# Altium schematic sheet Sheet1.SchDoc
size A3; SheetNumber: 1; SheetTotal: 2
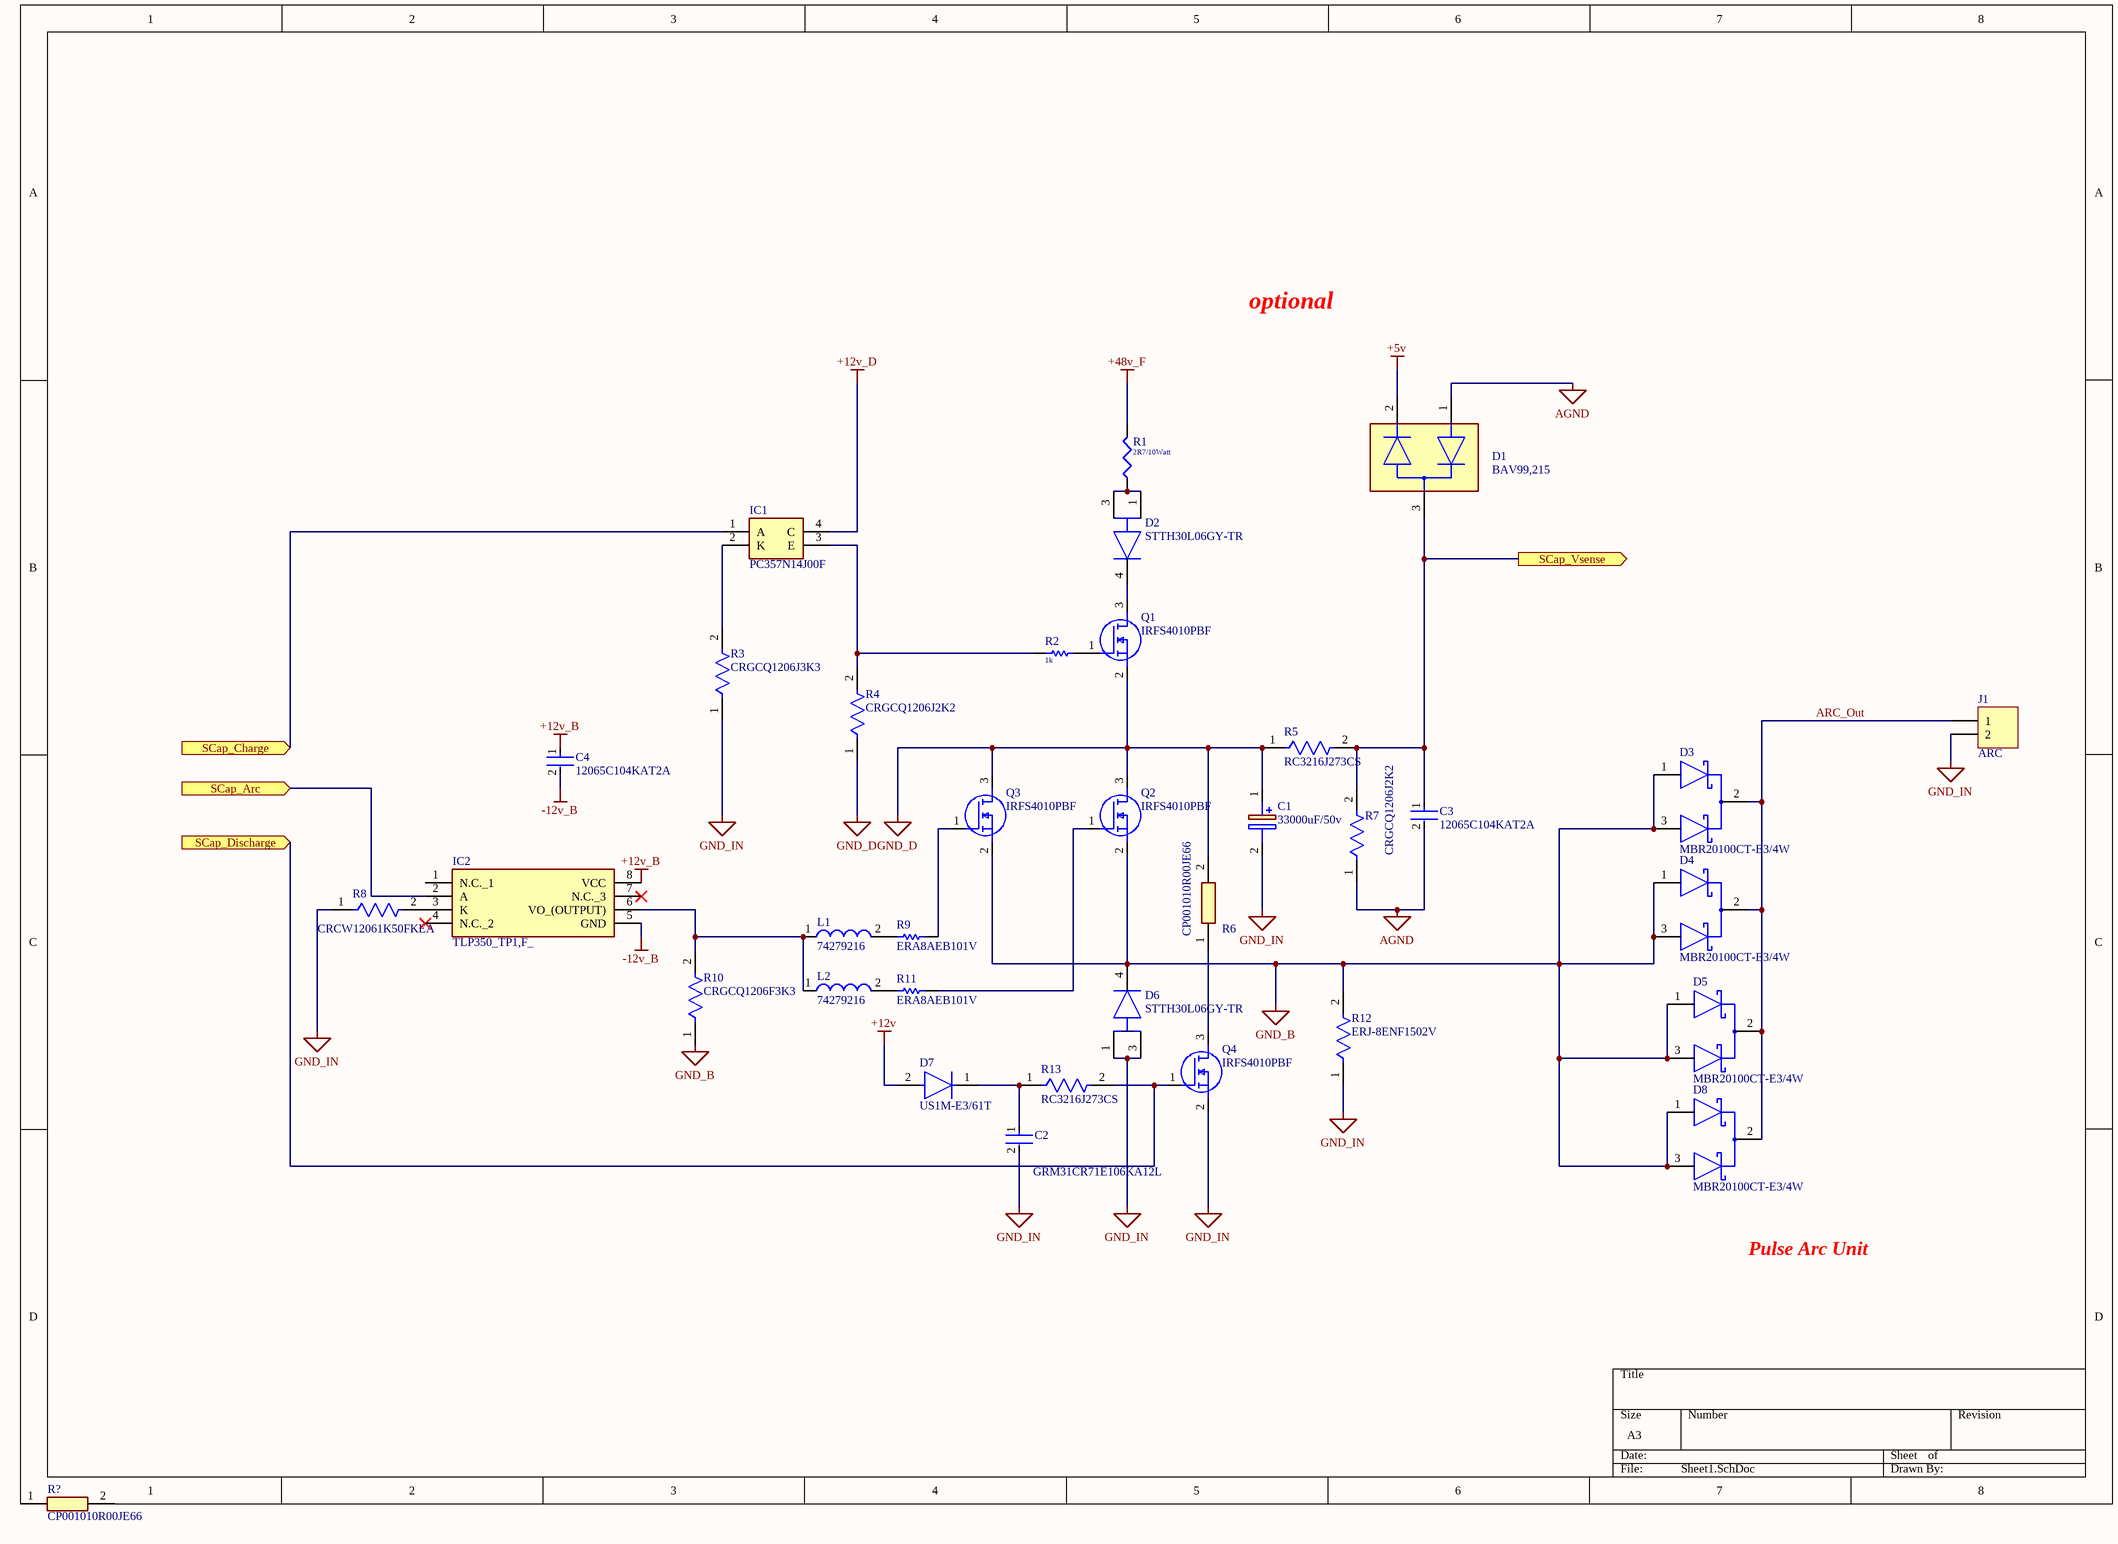
[diagram p0: Sheet1.SchDoc]

## Parts
C1  33000uF/50v  [CAPPRD1000W190D3550H8200]
C2  GRM31CR71E106KA12L  [FP-GRM31C-0_2-e0_3_0_8-MFG]
C3  12065C104KAT2A  [FP-1206-L_3_2_0_2-W_1_6_0-MFG]
C4  12065C104KAT2A  [FP-1206-L_3_2_0_2-W_1_6_0-MFG]
D1  BAV99,215  [FP-SOT23-MFG]
D2  STTH30L06GY-TR  [FP-D2PAK-MFG]
D3  MBR20100CT-E3/4W  [FP-MBR20100CT-E3-4W-MFG]
D4  MBR20100CT-E3/4W  [FP-MBR20100CT-E3-4W-MFG]
D5  MBR20100CT-E3/4W  [FP-MBR20100CT-E3-4W-MFG]
D6  STTH30L06GY-TR  [FP-D2PAK-MFG]
D7  US1M-E3/61T  [FP-95400-MFG]
D8  MBR20100CT-E3/4W  [FP-MBR20100CT-E3-4W-MFG]
IC1  PC357N14J00F  [SOP254P675X300-4N]
IC2  TLP350_TP1,F_  [DIP762W60P254L966H485Q8N]
J1  ARC  [PHM_TERMINAL2-PWR-10mm]
L1  74279216  [SMD-1206]
L2  74279216  [SMD-1206]
Q1  IRFS4010PBF  [IDB30E60]
Q2  IRFS4010PBF  [IDB30E60]
Q3  IRFS4010PBF  [IDB30E60]
Q4  IRFS4010PBF  [IDB30E60]
R1  2R7/10Watt  [PHM_AXIAL2.0]
R2  1k  [PHM_CR3216-1206]
R3  CRGCQ1206J3K3  [FP-CRGCQ1206-IPC_C]
R4  CRGCQ1206J2K2  [FP-CRGCQ1206-IPC_C]
R5  RC3216J273CS  [FP-RC3216-IPC_A]
R6  CP001010R00JE66  [CP001027K00JE663]
R7  CRGCQ1206J2K2  [FP-CRGCQ1206-IPC_C]
R8  CRCW12061K50FKEA  [FP-CRCW1206-e3-IPC_C]
R9  ERA8AEB101V  [RESC3216X70X50NL20T25]
R10  CRGCQ1206F3K3  [FP-CRGCQ1206-IPC_C]
R11  ERA8AEB101V  [RESC3216X70X50NL20T25]
R12  ERJ-8ENF1502V  [FP-ERJ8EN-MFG]
R13  RC3216J273CS  [FP-RC3216-IPC_A]
R?  CP001010R00JE66  [CP001027K00JE663]

## Ports
SCap_Arc (in), SCap_Charge (in), SCap_Discharge (in), SCap_Vsense (out)

## Nets
+5v: D1.2
+12v: D7.2(A)
+12v_B: C4.1 IC2.8(VCC)
+12v_D: IC1.4(C)
+48v_F: R1.2
-12v_B: C4.2 IC2.5(GND)
AGND: C3.2 D1.1 R7.1
GND_B: D3.1(1_ANODE) D3.3(2_ANODE) D4.1(1_ANODE) D4.3(2_ANODE) D5.1(1_ANODE) D5.3(2_ANODE) D6.4(K) D8.1(1_ANODE) D8.3(2_ANODE) Q2.2(S) Q3.2(S) R10.1 R12.2
GND_D: C1.1(+) Q1.2(S) Q2.3(D) Q3.3(D) R4.1 R5.1 R6.2
GND_IN: C1.2(-) C2.2 D6.1(A) D6.3(A) J1.2 Q4.2(S) R3.1 R8.1 R12.1
ARC_Out: D3.2(COMMON_CATHODE) D4.2(COMMON_CATHODE) D5.2(COMMON_CATHODE) D8.2(COMMON_CATHODE) J1.1
SCap_Arc: IC2.2(A) ; port SCap_Arc
SCap_Charge: IC1.1(A) ; port SCap_Charge
SCap_Discharge: Q4.1(G) R13.2 ; port SCap_Discharge
SCap_Vsense: C3.1 D1.3 R5.2 R7.2 ; port SCap_Vsense
NetC2_1: C2.1 D7.1(C) R13.1
NetD2_1: D2.1(A) D2.3(A) R1.1
NetD2_4: D2.4(K) Q1.3(D)
NetIC1_2: IC1.2(K) R3.2
NetIC1_3: IC1.3(E) R2.1 R4.2
NetIC2_3: IC2.3(K) R8.2
NetIC2_6: IC2.6(VO_(OUTPUT)) L1.1 L2.1 R10.2
NetL1_2: L1.2 R9.1
NetL2_2: L2.2 R11.1
NetQ1_1: Q1.1(G) R2.2
NetQ2_1: Q2.1(G) R11.2
NetQ3_1: Q3.1(G) R9.2
NetQ4_3: Q4.3(D) R6.1

Not connected (* = marked no-connect by the designer): IC2 1(N.C._1) 4(N.C._2)* 7(N.C._3)*; R? 1 2

## Notes on the sheet
- optional
- Pulse Arc Unit

## Library data of the parts
C1 = 380LX333M050A082: Capacitor Polarised; Manufacturer_Name: Cornell Dubilier; Datasheet Link: https://componentsearchengine.com/Datasheets/1/380LX333M050A082.pdf; Height: 82mm; Manufacturer_Part_Number: 380LX333M050A082; Mouser Part Number: 598-80LX333M050A082; Mouser Price/Stock: https://www.mouser.com/Search/Refine.aspx?Keyword=598-80LX333M050A082
C2 = CMP-06035-003589-1: Chip Multilayer Ceramic Capacitors for General Purpose, 1206, 10uF, X7R, 15%, 10%, 25V; Case Code (Imperial): 1206; Voltage Rating (DC): 25V; Voltage Rating: 25V; Length: 3.2mm; Lead Free: Lead Free; Thickness: 0.071inch; Package Quantity: 1; Width: 1.6mm; Max Operating Temperature: 125°C; Number of Pins: 2; Height: 1.6mm; Case Code (Metric): 3216; REACH SVHC: No SVHC; Radiation Hardening: No; Case/Package: 1206; Material: Ceramic; Tolerance: 10%; Voltage: 25V; Mount: Surface Mount; Packaging: Tape and Reel; Dielectric: X7R; Termination: SMD/SMT; Min Operating Temperature: -55°C; Capacitance: 10uF; Depth: 1.6mm
C3 C4 = CMP-2000-05018-2: General Purpose Ceramic Capacitor, 1206, 100nF, 10%, X7R, 15%, 50V; Dissipation Factor: 2.5%; Insulation Resistance: 100GR; Dielectric: X7R; Thickness: 0.037inch; Case Code (Imperial): 1206; Case Code (Metric): 3216; Dielectric Material: Ceramic; Width: 1.6mm; Voltage Rating (DC): 50V; Termination: SMD/SMT; Tolerance: 10%; REACH SVHC: No SVHC; Height: 0.94mm; Length: 3.2mm; Voltage: 50V; Capacitance: 100nF; Packaging: Tape and Reel; Depth: 1.6mm; Voltage Rating: 50V; Series: -; Contact Plating: Tin; Mount: Surface Mount; Package Quantity: 1; Construction: Flat; Max Operating Temperature: 125°C; Min Operating Temperature: -55°C; Case/Package: 1206; Lead Free: Lead Free; RoHS Compliant: Yes; Number of Pins: 2; Radiation Hardening: No
D1 = CMP-14399-000006-1: DIODE ARRAY GP 100V 215MA SOT23
D2 D6 = CMP-12188-000013-1: DIODE GEN PURP 600V 30A D2PAK; Manufacturer: STMicroelectronics; Automotive Grade: Grade 0; Max Junction Temp: +175°C; Standoff Height: 0.03mm; Max Surge Forward Current: 300A; Peak Reverse Current: 25uA; RoHS: TRUE; Temperature Range High: +175°C; ComponentLink2Description: Datasheet; Octopart: https://octopart.com/stth30l06gy-tr-stmicroelectronics-26451410; Manufacturer Part Number: STTH30L06GY-TR; Device Class L2: Diodes; Forward Current: 30A; Device Class L3: Rectifier Diodes; Digikey Description: DIODE GEN PURP 600V 30A D2PAK; Temperature: -40°C to +175°C; Temperature Range Low: -40°C; Max Repetitive Reverse Voltage: 600V; Category: Diode; Automotive: Yes; Package: D2PAK; Lead Free: Yes; Height: 4.83mm; Device Class L1: Discrete Semiconductors; ComponentLink2URL: https://www.st.com/resource/en/datasheet/stth30l06-y.pdf
D3-D5 D8 = CMP-00030-42878425-1: MBR20100CT-E3/4W Dual Common-Cathode High-Voltage Schottky Rectifier; Forward Voltage: 800mV; Max Junction Temperature (Tj): 150°C; Forward Current: 20A; Max Reverse Voltage (DC): 100V; Max Surge Current: 150A; Max Reverse Leakage Current: 100µA; Average Rectified Current: 10A; Element Configuration: Common Cathode; Length: 10.5156mm; Schedule B: 8541100080, 8541100080; Case/Package: TO-220AB; NexarPartId: 42878425; Number of Pins: 3; Min Operating Temperature: -65°C; Reverse Voltage: 100V; Height: 15.3162mm; Peak Non-Repetitive Surge Current: 150A; RoHS: Compliant; Max Operating Temperature: 150°C; Radiation Hardening: No; Lead Free: Lead Free; Mount: Through Hole; Max Repetitive Reverse Voltage (Vrrm): 100V; Max Forward Surge Current (Ifsm): 150A; Width: 4.699mm; Peak Reverse Current: 100µA
D7 = CMP-02540-000006-1: DIODE GEN PURP 1KV 1A DO214AC; Manufacturer: Vishay; Reverse Voltage: 1000V; Max Junction Temp: +150°C; Peak Reverse Current: 10uA; Max Surge Forward Current: 30A; Capacitance: 10pF; Description: Diode Standard 1000V 1A Surface Mount DO-214AC (SMA); Standoff Height: 0mm; Value: 10pF; Temperature Range Low: -55°C; Footprint Url: https://www.vishay.com/docs/95400/sma.pdf; Device Class L1: Discrete Semiconductors; Temperature: -55°C to +150°C; Max Repetitive Reverse Voltage: 1000V; ComponentLink2URL: https://www.vishay.com/docs/88768/us1.pdf; Category: Diode; Octopart: https://octopart.com/us1m-e3%2F61t-vishay-39553152; Digikey Description: DIODE GEN PURP 1KV 1A DO214AC; Device Class L2: Diodes; ComponentLink2Description: Datasheet; Height: 2.29mm; Automotive: No; RoHS: TRUE; Mouser Description: On a Reel of 1800, Vishay 1000V 1A, Silicon Junction Diode, 2-Pin DO-214AC US1M-E3/61T; Package: 95400; Forward Current: 1A; Temperature Range High: +150°C; Device Class L3: Rectifier Diodes; Manufacturer Part Number: US1M-E3/61T; Lead Free: Yes
IC1 = PC357N14J00F: Integrated Circuit; Manufacturer_Name: Sharp Microelectronics; Height: 3mm; Manufacturer_Part_Number: PC357N14J00F
IC2 = TLP350_TP1,F_: Integrated Circuit; Manufacturer_Name: Toshiba; Manufacturer_Part_Number: TLP350(TP1,F); Datasheet Link: https://toshiba.semicon-storage.com/info/docget.jsp?did=6217&prodName=TLP350; Height: 4.85mm; Mouser Part Number: 757-TLP350(TP1,F); Mouser Price/Stock: https://www.mouser.co.uk/ProductDetail/Toshiba/TLP350TP1F?qs=f0GatGUIxV3mNWWzK5NBiQ%3D%3D; Arrow Part Number: TLP350(TP1,F); Arrow Price/Stock: https://www.arrow.com/en/products/tlp350-tp1f/toshiba?region=asia
J1 = Header 2: Header, 2-Pin; Manufacturer: Generic Components; Class: Connector
L1 L2 = CMP-0220-00014-1: SMD EMI Suppression Ferrite Bead WE-CBF, Z = 1200 Ohm; PackageDescription: Chip Inductor, 2-Leads, Body 3.2 x 1.6 mm; PackageVersion: 2007; ComponentLink2URL: http://www.we-online.de/katalog/media/pdf/74279216.pdf; PackageReference: SMD-1206; ComponentLink2Description: Datasheet; ComponentLink1Description: Manufacturer Link; Impedance: 1200 Ohm; DatasheetVersion: Dec-2005; ComponentLink1URL: http://www.we-online.com
Q1-Q4 = IRFS4010PBF: MOSFET (N-Channel); Manufacturer_Name: Infineon; Datasheet Link: http://uk.rs-online.com/web/p/products/6887080; Manufacturer_Part_Number: IRFS4010PBF; Mouser Part Number: 942-IRFS4010PBF; Mouser Price/Stock: https://www.mouser.com/Search/Refine.aspx?Keyword=942-IRFS4010PBF
R1 = Res3: Resistor; Published: 8-Jun-2000; LatestRevisionDate: 29-May-2009; LatestRevisionNote: IPC-7351 Footprint Added.; PackageReference: J1-0603; Publisher: Altium Limited; PackageDescription: Chip Resistor; Value: 2R7/10Watt
R2 = Res1: Resistor; Published: 8-Jun-2000; LatestRevisionDate: 17-Jul-2002; LatestRevisionNote: Re-released for DXP Platform.; PackageReference: AXIAL-0.3; Publisher: Altium Limited; Value: 1k
R3 = CMP-03211-010046-1: CRGCQ1206 3.3KΩ 0.25W 5% ±100ppm/°C 200V; Manufacturer: TE Connectivity; Tolerance: 0.05; Automotive Grade: Grade 800; Temperature Coefficient: ±100ppm/°C; Device Class L2: Resistors; Device Class L1: Passive Components; Octopart: https://octopart.com/crgcq1206j3k3-te+connectivity-91018329; Resistance: 3.3KΩ; Ambient Temperature Range High: +70°C; ComponentLink2URL: https://www.te.com/commerce/DocumentDelivery/DDEController?Action=showdoc&DocId=Data+Sheet%7F1773204-3%7F1%7Fpdf%7FEnglish%7FENG_DS_1773204-3_1.pdf%7F4-2176347-809; Device Class L3: Chip SMD Resistors; Manufacturer Part Number: CRGCQ1206J3K3; ComponentLink2Description: Datasheet; Height: 0.65mm; Value: 3.3KΩ; Lead Free: Yes; Power Rating: 0.25W; Category: Res; Temperature: -55°C to +155°C; Composition: Thick Film; Package: CRGCQ1206; Temperature Range High: +155°C; Voltage Rating: 200V; Temperature Range Low: -55°C; Automotive: Yes; RoHS: TRUE; Series: CRGCQ; Ipc Land Pattern Name: RESC310155X55
R4 R7 = CMP-03211-005605-1: CRGCQ 1206 2K2 5%; Manufacturer: TE Connectivity; Value: 2.2KΩ; Automotive Grade: Grade 758; Tolerance: 0.05; Voltage Rating: 200V; Temperature Coefficient: ±100ppm/°C; Power Rating: 0.25W; Description: CRGCQ1206 2.2KΩ 0.25W 5% ±100ppm/°C 200V; Device Class L2: Resistors; Lead Free: Yes; ComponentLink2URL: https://www.te.com/commerce/DocumentDelivery/DDEController?Action=showdoc&DocId=Data+Sheet%7F1773204-3%7F1%7Fpdf%7FEnglish%7FENG_DS_1773204-3_1.pdf%7F4-2176347-767; RoHS: TRUE; Resistance: 2.2KΩ; Category: Res; Series: CRGCQ; Height: 0.65mm; Digikey Description: CRGCQ 1206 2K2 5%; Manufacturer Part Number: CRGCQ1206J2K2; Temperature: -55°C to +155°C; ComponentLink2Description: Datasheet; Device Class L3: Chip SMD Resistors; Temperature Range Low: -55°C; Composition: Thick Film; Ambient Temperature Range High: +70°C; Temperature Range High: +155°C; Package: CRGCQ1206; Octopart: https://octopart.com/crgcq1206j2k2-te+connectivity-91018322; Device Class L1: Passive Components; Ipc Land Pattern Name: RESC310155X55; Automotive: Yes
R5 R13 = CMP-13261-004377-1: Res Thick Film 1206 27kΩ 5% 0.25W ±100ppm/°C Molded SMD T/R; Voltage Rating (DC): 200V; Max Power Dissipation: 250mW; Resistance: 27kR; Height: 0.026inch; Case Code (Imperial): 1206; Contact Plating: Tin; Features: Moisture Resistant; Case Code (Metric): 3216; Length: 0.126inch; Case/Package: 1206; Packaging: Tape and Reel; Temperature Coefficient: 100ppm/°C; Number of Terminations: 2; Min Operating Temperature: -55°C; Tolerance: 5%; Radiation Hardening: No; Composition: Thick Film; Width: 0.063inch; Lead Free: Lead Free; Max Operating Temperature: 155°C
R6 R? = CP001010R00JE66: Resistor; Manufacturer_Name: Vishay; Datasheet Link: https://www.vishay.com/docs/30113/cphivol.pdf; Height: 13.5mm; Manufacturer_Part_Number: CP001010R00JE66; Mouser Part Number: 71-CP001010R00JE66; Mouser Price/Stock: https://www.mouser.com/Search/Refine.aspx?Keyword=71-CP001010R00JE66; Arrow Part Number: CP001010R00JE66; Arrow Price/Stock: https://www.arrow.com/en/products/cp001010r00je66/vishay
R8 = CMP-02407-002229-1: RES Thick Film, 1.5kΩ, 1%, 0.25W, 100ppm/°C, 1206; Voltage Rating (DC): 200V; Power Rating: 250mW; Resistance: 1.5kR; Depth: 1.6mm; Case/Package: 1206; Packaging: Tape and Reel; Military Standard: Not; Radiation Hardening: No; Features: Automotive AEC-Q200; Number of Terminations: 2; Case Code (Imperial): 1206; Width: 0.063inch; Voltage Rating: 200V; Tolerance: 1%; Max Operating Temperature: 155°C; Weight: 0.000353oz; Package Quantity: 10; Temperature Coefficient: 100ppm/°C; Lead Free: Lead Free; Height: 0.024inch; Max Power Dissipation: 250mW; Termination: SMD/SMT; Length: 3.2mm; Contact Plating: Tin; Composition: Thick Film; Min Operating Temperature: -55°C; Case Code (Metric): 3216
R9 R11 = CMP-2003-04405-1: Manufacturer: Panasonic; Part Number: ERA8AEB101V
R10 = CMP-03211-006652-1: CRGCQ1206 3.3KΩ 0.25W 1% ±100ppm/°C 200V; Manufacturer: TE Connectivity; Tolerance: 0.01; Automotive Grade: Grade 799; Height: 0.65mm; Automotive: Yes; Device Class L3: Chip SMD Resistors; Category: Res; Ambient Temperature Range High: +70°C; Resistance: 3.3KΩ; Mouser Description: Res Thick Film 1206 3.3K Ohm 1% 0.25W(1/4W) ±100ppm/C Pad SMD Automotive T/R; Octopart: https://octopart.com/crgcq1206f3k3-te+connectivity-91018281; ComponentLink2Description: Datasheet; RoHS: TRUE; Package: CRGCQ1206; Temperature Range High: +155°C; Series: CRGCQ; Voltage Rating: 200V; Device Class L1: Passive Components; Temperature Range Low: -55°C; Manufacturer Part Number: CRGCQ1206F3K3; Temperature Coefficient: ±100ppm/°C; ComponentLink2URL: https://www.te.com/commerce/DocumentDelivery/DDEController?Action=showdoc&DocId=Data+Sheet%7F1773204-3%7F1%7Fpdf%7FEnglish%7FENG_DS_1773204-3_1.pdf%7F4-2176347-808; Composition: Thick Film; Ipc Land Pattern Name: RESC310155X55; Device Class L2: Resistors; Lead Free: Yes; Power Rating: 0.25W; Temperature: -55°C to +155°C; Value: 3.3KΩ
R12 = CMP-2003-00118-2: NexarPartId: 55423295; Voltage Rating: 200V; Temperature Coefficient: 100ppm/°C; Resistance: 15kΩ; Max Power Dissipation: 250mW; Tolerance: 1%; Military Standard: Not; Min Operating Temperature: -55°C; Height: 600µm; Termination: SMD/SMT; Composition: Thick Film; Mount: Surface Mount; Voltage Rating (DC): 200V; Lead Free: Lead Free; Features: Automotive AEC-Q200; Radiation Hardening: No; Number of Terminations: 2; Contact Plating: Tin; Lifecycle Status: Production; Schedule B: 8533210045, 8533210045; Max Operating Temperature: 155°C; Packaging: Cut Tape (CT); Length: 3.2mm; Power Rating: 250mW; Width: 1.6mm; RoHS: Compliant; Number of Pins: 2; Depth: 1.6mm; Case Code (Imperial): 1206; Case/Package: 1206; REACH SVHC: No SVHC; Case Code (Metric): 3216